# Altium schematic sheet Glasses-LEDBoard.SchDoc
size A4
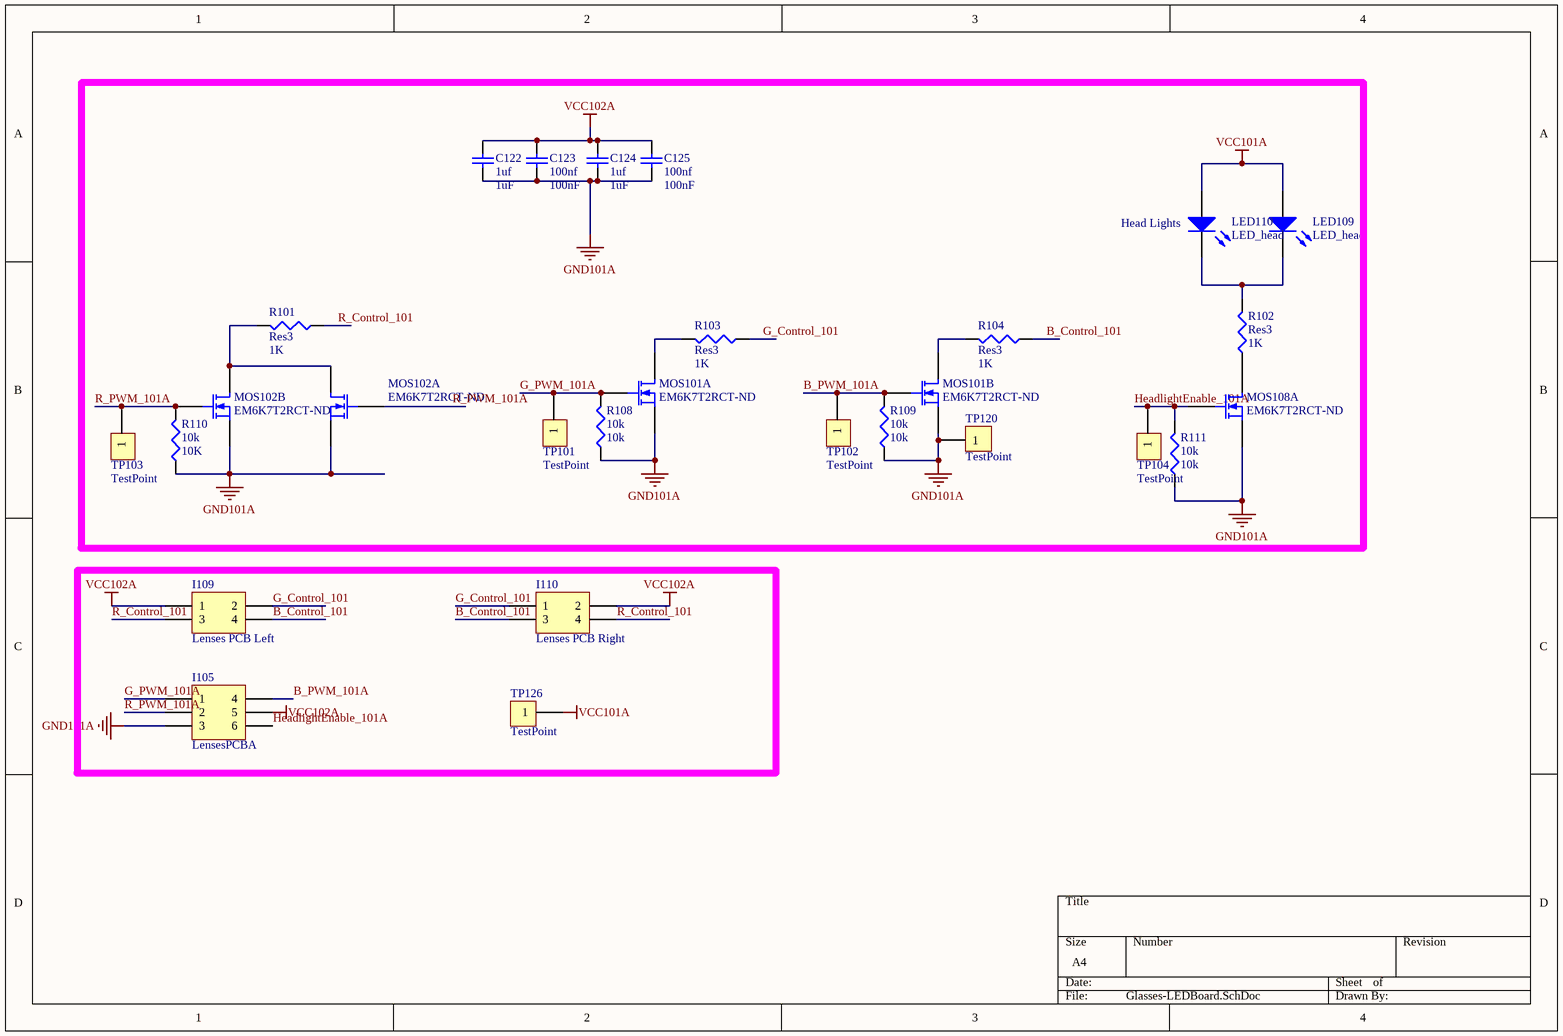
[diagram p0: Glasses-LEDBoard.SchDoc]

## Parts
C122  1uf  [0603]
C123  100nf  [0603]
C124  1uf  [0603]
C125  100nf  [0603]
I105  LensesPCBA  [Valve male]
I109  Lenses PCB Left  [4-Pin Pad]
I110  Lenses PCB Right  [4-Pin Pad]
LED109  LED_head  [LED Headlamp]
LED110  LED_head  [LED Headlamp]
MOS101  EM6K7T2RCT-ND  [EM6K7T2R-EMT6]  (parts A,B of 2)
MOS102  EM6K7T2RCT-ND  [EM6K7T2R-EMT6]  (parts A,B of 2)
MOS108  EM6K7T2RCT-ND  [EM6K7T2R-EMT6]  (part A of 2)
R101  Res3  value 1K  [0805]
R102  Res3  value 1K  [0805]
R103  Res3  value 1K  [0805]
R104  Res3  value 1K  [0805]
R108  10k  [0603]
R109  10k  [0603]
R110  10k  [0603]
R111  10k  [0603]
TP101  TestPoint  [TestPoint]
TP102  TestPoint  [TestPoint]
TP103  TestPoint  [TestPoint]
TP104  TestPoint  [TestPoint]
TP120  TestPoint  [TestPoint]
TP126  TestPoint  [TestPoint]

## Blocks framed on the sheet
Head Lights: C122-C125 LED109 LED110 MOS101 MOS102 MOS108 R101-R104 R108-R111 TP101-TP104 TP120

## Nets
GND101A: C122.1 C123.1 C124.1 C125.1 I105.3 MOS101.3(S) MOS101.6(S) MOS102.3(S) MOS102.6(S) MOS108.3(S) R108.1 R109.1 R110.1 R111.1 TP120.1
VCC101A: LED109.1(A) LED110.1(A) TP126.1
VCC102A: C122.2 C123.2 C124.2 C125.2 I105.5 I109.1 I110.2
B_Control_101: I109.4 I110.3 R104.1
B_PWM_101A: I105.4 MOS101.5(G) R109.2 TP102.1
G_Control_101: I109.2 I110.1 R103.1
G_PWM_101A: I105.1 MOS101.2(G) R108.2 TP101.1
HeadlightEnable_101A: I105.6 MOS108.2(G) R111.2 TP104.1
R_Control_101: I109.3 I110.4 R101.1
R_PWM_101A: I105.2 MOS102.2(G) MOS102.5(G) R110.2 TP103.1
NetLED109_2: LED109.2(K) LED110.2(K) R102.2
NetMOS101_1: MOS101.1(D) R103.2
NetMOS101_4: MOS101.4(D) R104.2
NetMOS102_1: MOS102.1(D) MOS102.4(D) R101.2
NetMOS108_1: MOS108.1(D) R102.1

## Library data of the parts
C122-C125 = Cap Semi: Capacitor (Semiconductor SIM Model); Published: 8-Jun-2000; LatestRevisionDate: 29-May-2009; LatestRevisionNote: IPC-7351 Footprint Added.; PackageReference: C1206; Publisher: Altium Limited; PackageDescription: Chip Capacitor
  C122 C124: Value: 1uF
  C123 C125: Value: 100nF
I105 = Header 3X2A: Header, 3-Pin, Dual row; LatestRevisionDate: 17-Jul-2002; LatestRevisionNote: Re-released for DXP Platform.; Publisher: Altium Limited
I109 I110 = Header 2X2: Header, 2-Pin, Dual row; LatestRevisionDate: 17-Jul-2002; LatestRevisionNote: Re-released for DXP Platform.; Publisher: Altium Limited
LED109 LED110 = LED0: Typical INFRARED GaAs LED; Published: 8-Jun-2000; LatestRevisionDate: 08-Jul-2005; LatestRevisionNote: Mech Layer 1 removed.; PackageReference: LED-0; Publisher: Altium Limited
R101-R104 R108-R111 = Res3: Resistor; Published: 8-Jun-2000; LatestRevisionDate: 29-May-2009; LatestRevisionNote: IPC-7351 Footprint Added.; PackageReference: J1-0603; Publisher: Altium Limited; PackageDescription: Chip Resistor
  R108 R109 R111: Value: 10k
  R110: Value: 10K
MOS101 MOS102 MOS108 = EM6K7T2RCT-ND: Supplier 1: Digi-Key